# EAGLE design GPRS+GSM+GPS Shield v1.0 (EAGLE 6.3)
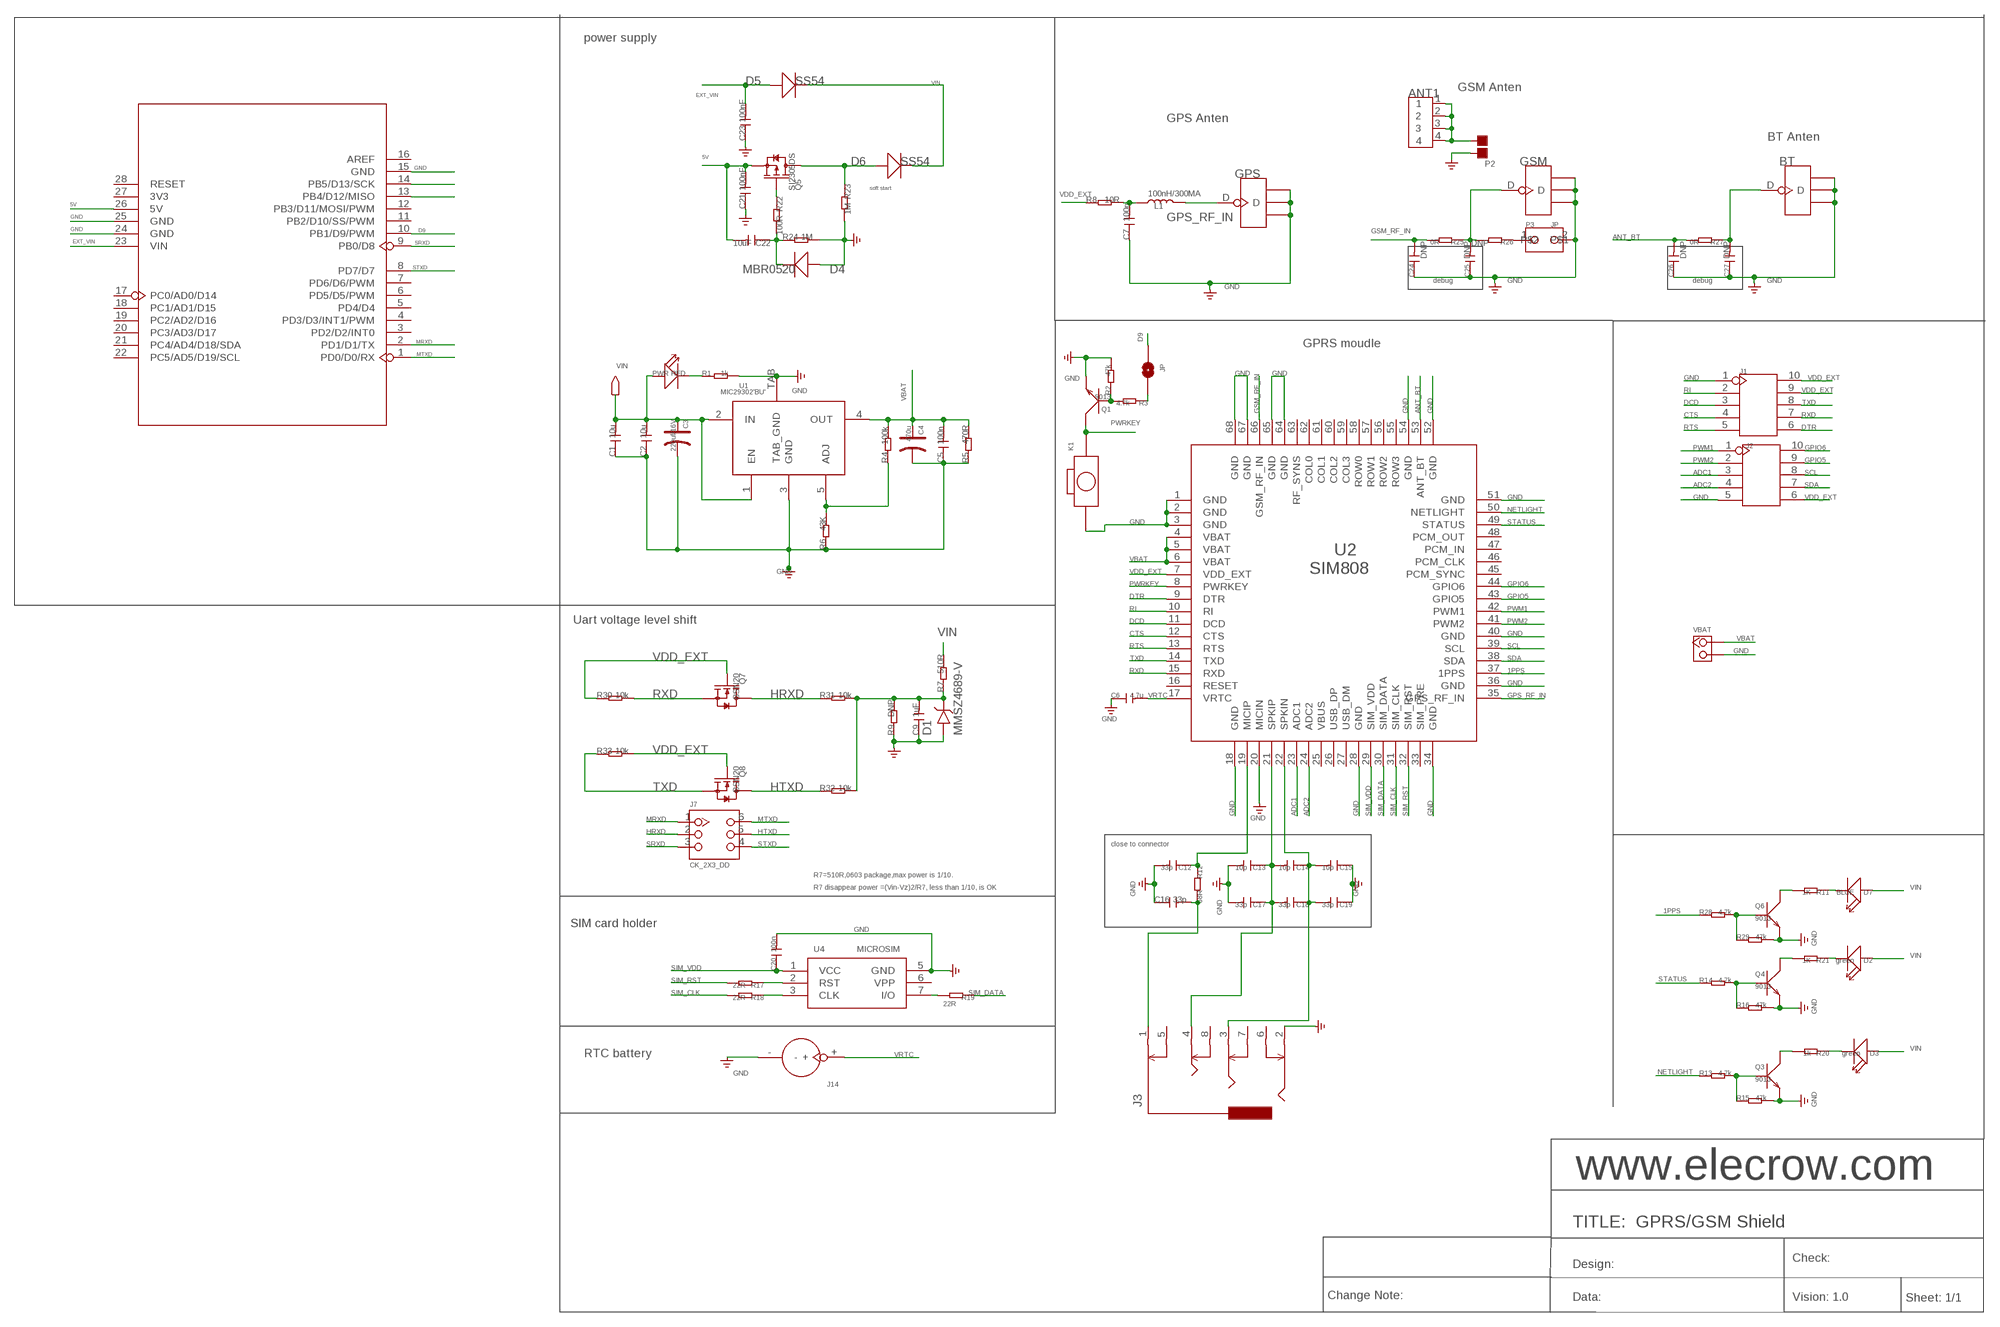
[diagram p0: schematic, sheet 1]

## Parts
ANT1  ANTENNA-SMA-IPX  [SMA-TO-IPX]
BT  ANTENNA-U-FL  [4P-U-FL]
C1  10u  C-0603  [C0603]
C2  10u  C-0603  [C0603]
C3  220uf/16V  006-CAP_AVX_D  [AVX_D]
C4  470u  006-CAP_AVX_D  [AVX_D]
C5  100n  C-0603  [C0603]
C6  4.7u  C-0805  [C0805]
C7  100n  C-0603  [C0603]
C9  1uF  C-0603  [C0603]
C12  33p  C-0603  [C0603]
C13  10p  C-0402  [C0402]
C14  10p  C-0402  [C0402]
C15  10p  C-0402  [C0402]
C16  33p  C-0603  [C0603]
C17  33p  C-0402  [C0402]
C18  33p  C-0402  [C0402]
C19  33p  C-0402  [C0402]
C20  100n  C-0603  [C0603]
C21  100nF  C-0603  [C0603]
C22  10uF  C-0805  [C0805]
C23  100nF  C-0603  [C0603]
C24  DNP  C-0402  [C0402]
C25  DNP  C-0402  [C0402]
C26  DNP  C-0402  [C0402]
C27  DNP  C-0402  [C0402]
D1  MMSZ4689-V  D-VOL'MMSZ4681'  [SOD123-2.7X1.6]
D2  green  LED'0603'  [LED-0603]
D3  green  LED'0603'  [LED-0603]
D4  MBR0520  D'MBR0520LT1'  [SOD123-2.7X1.6]
D5  SS54  D'MBRS240LT3'  [SMB]
D6  SS54  D'MBRS240LT3'  [SMB]
D7  BLUE  LED'0603'  [LED-0603]
GPS  ANTENNA-U-FL  [4P-U-FL]
GSM  ANTENNA-U-FL  [4P-U-FL]
J1  HEADER-2X5P-2.54  [2X5P-2.54]
J2  HEADER-2X5P-2.54  [2X5P-2.54]
J3  AUDIO-8P'PJ-3536-L6S'  [8P-3.5-SMD]
J7  CK_2X3_DD  [CK_2X3]
J14  HOLDER-BATTERY-2P-CR1220  [CR1220]
JP  0R/0805  PAD-SOLDERJUMPERNC  [2P-SMD-3.3X2]
K1  BOTTON_1_DP  [BTN_5.0_RST]
L1  100nH/300MA  L'0603'  [L0603]
P2  PAD-JUMPER-2P  [2P-SMD-1.78X1.27]
P3  JP  [JP]
PWR  RED  007-LED0603  [D0603]
Q1  9013  TRANSISTOR-NPN-SOT23  [SOT23]
Q3  9013  TRANSISTOR-NPN-SOT23  [SOT23]
Q4  9013  TRANSISTOR-NPN-SOT23  [SOT23]
Q5  SI2305DS  MOSFET-P'SI2323CDS/SI2305DS<BR>'  [SOT23]
Q6  9013  TRANSISTOR-NPN-SOT23  [SOT23]
Q7  BSN20  MOSFET-N'SOT23'  [SOT23]
Q8  BSN20  MOSFET-N'SOT23'  [SOT23]
R1  1k  R-0603  [R0603]
R2  47k  R-0603  [R0603]
R3  4.7k  R-0603  [R0603]
R4  100k  R-0603  [R0603]
R5  470R  R-0603  [R0603]
R6  43K  R-0603  [R0603]
R7  510R  R-0603  [R0603]
R8  10R  R-0603  [R0603]
R9  DNP  R-0603  [R0603]
R11  1K  R-0603  [R0603]
R12  68R  R-0603  [R0603]
R13  4.7k  R-0603  [R0603]
R14  4.7k  R-0603  [R0603]
R15  47k  R-0603  [R0603]
R16  47k  R-0603  [R0603]
R17  22R  R-0603  [R0603]
R18  22R  R-0603  [R0603]
R19  22R  R-0603  [R0603]
R20  1k  R-0603  [R0603]
R21  1K  R-0603  [R0603]
R22  100R  R-0603  [R0603]
R23  1M  R-0603  [R0603]
R24  1M  R-0603  [R0603]
R25  0R  R-0402  [R0402]
R26  DNP  R-0402  [R0402]
R27  0R  R-0402  [R0402]
R28  4.7k  R-0603  [R0603]
R29  47k  R-0603  [R0603]
R30  10k  R-0603  [R0603]
R31  10k  R-0603  [R0603]
R32  10k  R-0603  [R0603]
R33  10k  R-0603  [R0603]
U1  MIC29302'BU'  [TO-263]
U2  SIM808  [SIM808]
U3  UNO-SHILED  [SHILED]
U4  MICROSIM  [MICROSIM]
VBAT  DNP  HEADER_1X2_2.54  [CK_1*2]

## Nets
1PPS: R28.1 U2.37(1PPS)
5V: C21.2 C22.2 Q5.2(S) U3.26(5V)
ADC1: J2.3 U2.23(ADC1)
ADC2: J2.4 U2.24(ADC2)
ANT_BT: C26.2 R27.2 U2.53(ANT_BT)
CTS: J1.4 U2.12(CTS)
D9: JP.1 U3.10(PB1/D9/PWM)
DCD: J1.3 U2.11(DCD)
DTR: J1.6 U2.9(DTR)
EXT_VIN: C23.2 D5.+ U3.23(VIN)
GND: BT.GND1 BT.GND2 BT.GND3 C1.1 C2.1 C3.- C4.- C5.1 C6.1 C7.1 C9.1 C12.2 C13.2 C15.1 C16.1 C17.2 C19.1 C20.2 C21.1 C23.1 C24.1 C25.1 C26.1 C27.1 D1.1 D4.1(+) GPS.GND1 GPS.GND2 GPS.GND3 GSM.GND1 GSM.GND2 GSM.GND3 J1.1 J2.5 J3.2 J14.- K1.P$1 P2.2 P3.2 Q1.2(E) Q3.2(E) Q4.2(E) Q6.2(E) R1.2 R2.2 R5.1 R6.1 R9.1 R15.2 R16.2 R23.2 R24.2 R29.2 U1.3(GND) U1.TAB(TAB_GND) U2.1(GND) U2.2(GND) U2.3(GND) U2.18(GND) U2.20(MICIN) U2.28(GND) U2.34(GND) U2.36(GND) U2.40(GND) U2.51(GND) U2.52(GND) U2.54(GND) U2.64(GND) U2.65(GND) U2.67(GND) U2.68(GND) U3.15(GND) U3.24(GND) U3.25(GND) U4.5(GND) VBAT.2
GPIO5: J2.9 U2.43(GPIO5)
GPIO6: J2.10 U2.44(GPIO6)
GPS_RF_IN: GPS.D L1.2 U2.35(GPS_RF_IN)
GSM_RF_IN: C24.2 R25.2 U2.66(GSM_RF_IN)
HRXD: J7.2 Q7.3(D) R31.1
HTXD: J7.5 Q8.3(D) R32.1
MRXD: J7.1 U3.2(PD1/D1/TX)
MTXD: J7.6 U3.1(PD0/D0/RX)
N$1: R19.2 U4.7(I/O)
N$2: R4.1 R6.2 U1.5(ADJ)
N$3: Q3.3(C) R20.2
N$4: Q6.3(C) R11.2
N$5: R18.1 U4.3(CLK)
N$6: R17.1 U4.2(RST)
N$7: D3.- R20.1
N$8: Q3.1(B) R13.2 R15.1
N$9: C9.2 D1.2 R7.1 R9.2 R31.2 R32.2
N$11: Q5.1(G) R22.1
N$12: ANT1.1 ANT1.2 ANT1.3 ANT1.4 P2.1
N$13: C12.1 R12.1 U2.19(MICIP)
N$14: JP.2 R3.1
N$15: C13.1 C14.2 C17.1 C18.2 J3.4 U2.21(SPKIP)
N$16: Q4.3(C) R21.2
N$17: D2.- R21.1
N$18: Q4.1(B) R14.2 R16.1
N$19: C14.1 C15.2 C18.1 C19.2 J3.3 U2.22(SPKIN)
N$20: D6.+ Q5.3(D) R23.1
N$21: C7.2 L1.1 R8.2
N$22: D7.- R11.1
N$23: U3.14(PB5/D13/SCK)
N$24: Q6.1(B) R28.2 R29.1
N$25: C25.2 GSM.D R25.1 R26.2
N$26: P3.1 R26.1
N$27: U3.13(PB4/D12/MISO)
N$28: BT.D C27.2 R27.1
N$30: C16.2 J3.1 R12.2
N$36: Q1.1(B) R2.1 R3.2
N$39: C22.1 D4.2(-) R22.2 R24.1
N$53: PWR.- R1.1
NETLIGHT: R13.1 U2.50(NETLIGHT)
PWM1: J2.1 U2.42(PWM1)
PWM2: J2.2 U2.41(PWM2)
PWRKEY: K1.P$2 Q1.3(C) U2.8(PWRKEY)
RI: J1.2 U2.10(RI)
RTS: J1.5 U2.13(RTS)
RXD: J1.7 Q7.2(S) R30.2 U2.15(RXD)
SCL: J2.8 U2.39(SCL)
SDA: J2.7 U2.38(SDA)
SIM_CLK: R18.2 U2.31(SIM_CLK)
SIM_DATA: R19.1 U2.30(SIM_DATA)
SIM_RST: R17.2 U2.32(SIM_RST)
SIM_VDD: C20.1 U2.29(SIM_VDD) U4.1(VCC)
SRXD: J7.3 U3.9(PB0/D8)
STATUS: R14.1 U2.49(STATUS)
STXD: J7.4 U3.8(PD7/D7)
TXD: J1.8 Q8.2(S) R33.1 U2.14(TXD)
VBAT: C4.+ C5.2 R4.2 R5.2 U1.4(OUT) U2.4(VBAT) U2.5(VBAT) U2.6(VBAT) VBAT.1
VDD_EXT: J1.9 J1.10 J2.6 Q7.1(G) Q8.1(G) R8.1 R30.1 R33.2 U2.7(VDD_EXT)
VIN: C1.2 C2.2 C3.+ D2.+ D3.+ D5.- D6.- D7.+ PWR.+ R7.2 U1.1(EN) U1.2(IN)
VRTC: C6.2 J14.+ U2.17(VRTC)
Unconnected: J3.5 J3.6 J3.7 J3.8 U2.16(RESET) U2.25(VBUS) U2.26(USB_DP) U2.27(USB_DM) U2.33(SIM_PRE) U2.45(PCM_SYNC) U2.46(PCM_CLK) U2.47(PCM_IN) U2.48(PCM_OUT) U3.3(PD2/D2/INT0) U3.4(PD3/D3/INT1/PWM) U3.5(PD4/D4) U3.6(PD5/D5/PWM) U3.7(PD6/D6/PWM) U3.11(PB2/D10/SS/PWM) U3.12(PB3/D11/MOSI/PWM) U3.16(AREF) U3.17(PC0/AD0/D14) U3.18(PC1/AD1/D15) U3.19(PC2/AD2/D16) U3.20(PC3/AD3/D17) U3.21(PC4/AD4/D18/SDA) U3.22(PC5/AD5/D19/SCL) U3.27(3V3) U3.28(RESET) U4.6(VPP)

## Notes on the sheet
- power supply
- GSM Anten
- GPS Anten
- BT Anten
- soft start
- debug | debug
- GPRS moudle
- Uart voltage level shift
- close to connector
- R7=510R,0603 package,max power is 1/10.
- R7 disappear power =(Vin-Vz)2/R7, less than 1/10, is OK
- SIM card holder
- RTC battery
- www.elecrow.com
- TITLE:  GPRS/GSM Shield
- Check:
- Design:
- Change Note: | Data: | Vision: 1.0 | Sheet: 1/1

## Power pins joined to a net without a drawn wire
COL0: U2.62(COL0)
COL1: U2.61(COL1)
COL2: U2.60(COL2)
COL3: U2.59(COL3)
RF_SYNS: U2.63(RF_SYNS)
ROW0: U2.58(ROW0)
ROW1: U2.57(ROW1)
ROW2: U2.56(ROW2)
ROW3: U2.55(ROW3)

## Library data of the parts
ANT1 = Connector:ANTENNA-SMA-IPX
BT GPS GSM = Connector:ANTENNA-U-FL
C1 C2 C5-C7 C9 C12-C27 = Discrete:C*: Ceramic Capacitors
C3 C4 = Discrete:006-CAP*: Electrolytic Capacitors,Tantalum Capacitors and Super Capacitors
D1 = template:D-VOL
D2 D3 D7 = Discrete:LED*
D4-D6 = Discrete:D*
J1 J2 = Connector:HEADER-2X5P
J3 = template:AUDIO-8P
J7 = CONNECTER:CK_2X3
J14 = Connector:HOLDER-BATTERY-2P
JP = Discrete:PAD-SOLDERJUMPER: Solder Jumper Standard SMD solder jumper. Used to automate production. Two varients : Normally Open and Normally Closed are the same, but have different paste layers. NC will have a large amount of paste and should jumper during reflow.
K1 = CPT_SMD:BOTTON_1
L1 = Discrete:L*
P2 = Discrete:PAD-JUMPER-2P; PARTNO: DNP
P3 = mySeeed:JP
PWR = Discrete:007-LED*
Q1 Q3 Q4 Q6 = Discrete:TRANSISTOR-NPN*: NPN audion
Q5 = Discrete:MOSFET-P
Q7 Q8 = Discrete:MOSFET-N: IRLL014: http://www.vishay.com/docs/91319/sihll014.pdf
R1-R9 R11-R33 = Discrete:R*
U1 = ICs_v54:MIC29302
U2 = moudle:SIM808
U3 = ljb:UNO-SHILED
U4 = Connector:MICROSIM
VBAT = CONNECTER:HEADER_1X2

## Net classes
0 default: width 0.152 mm, drill 0.152 mm, clearance 0.152 mm

## Board
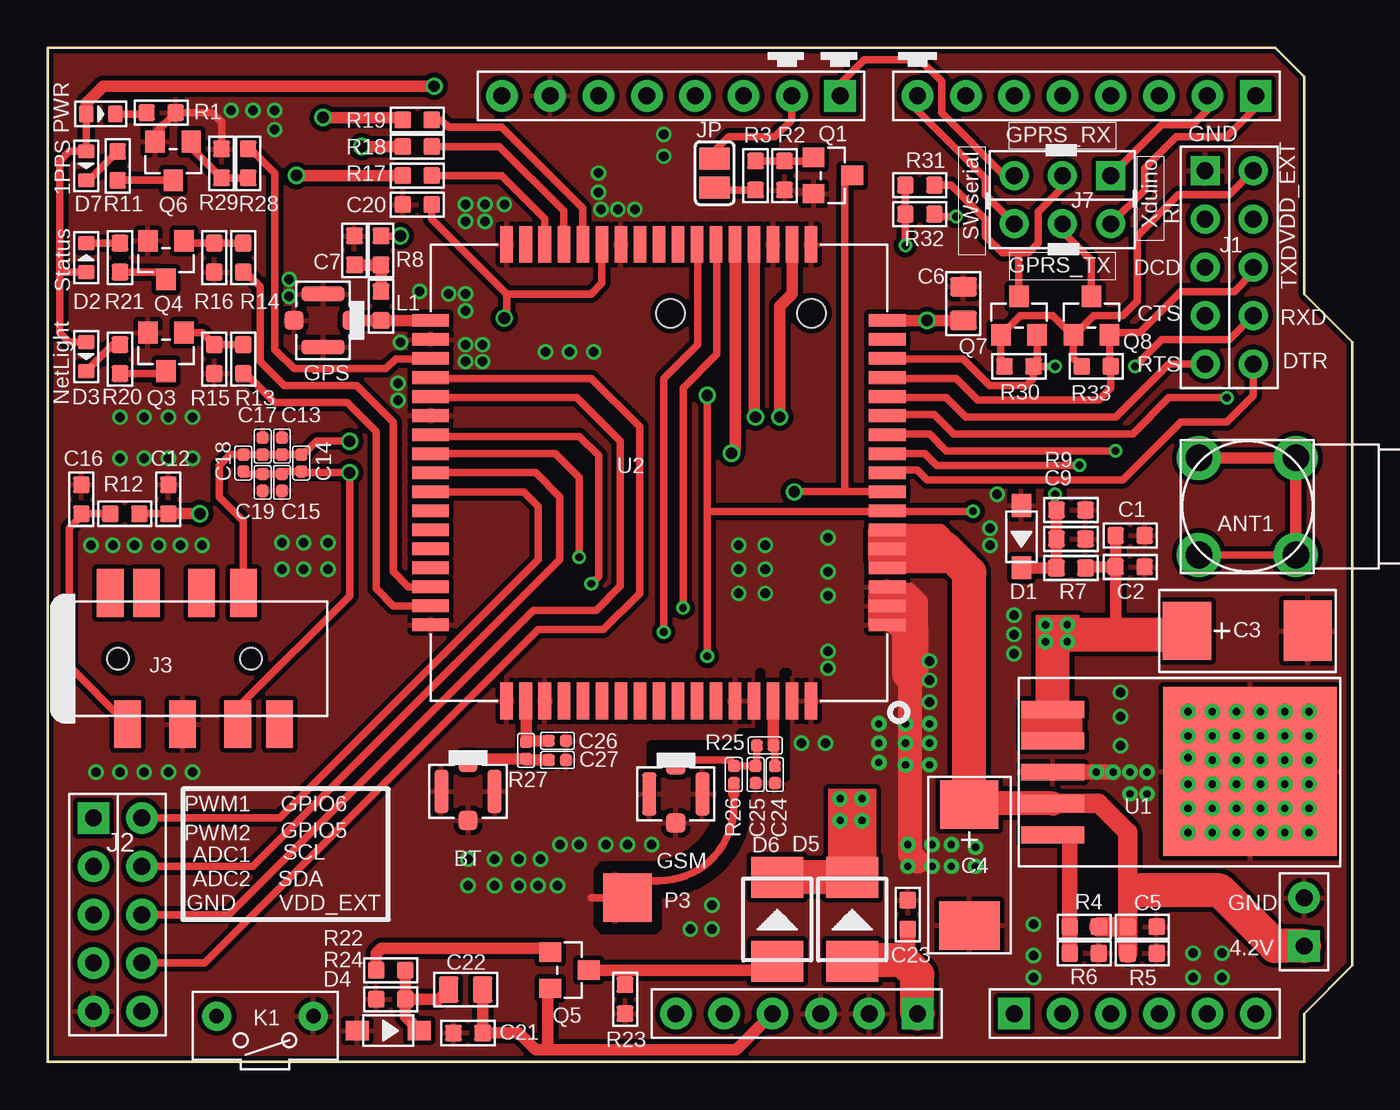
[diagram p1: board, top side]
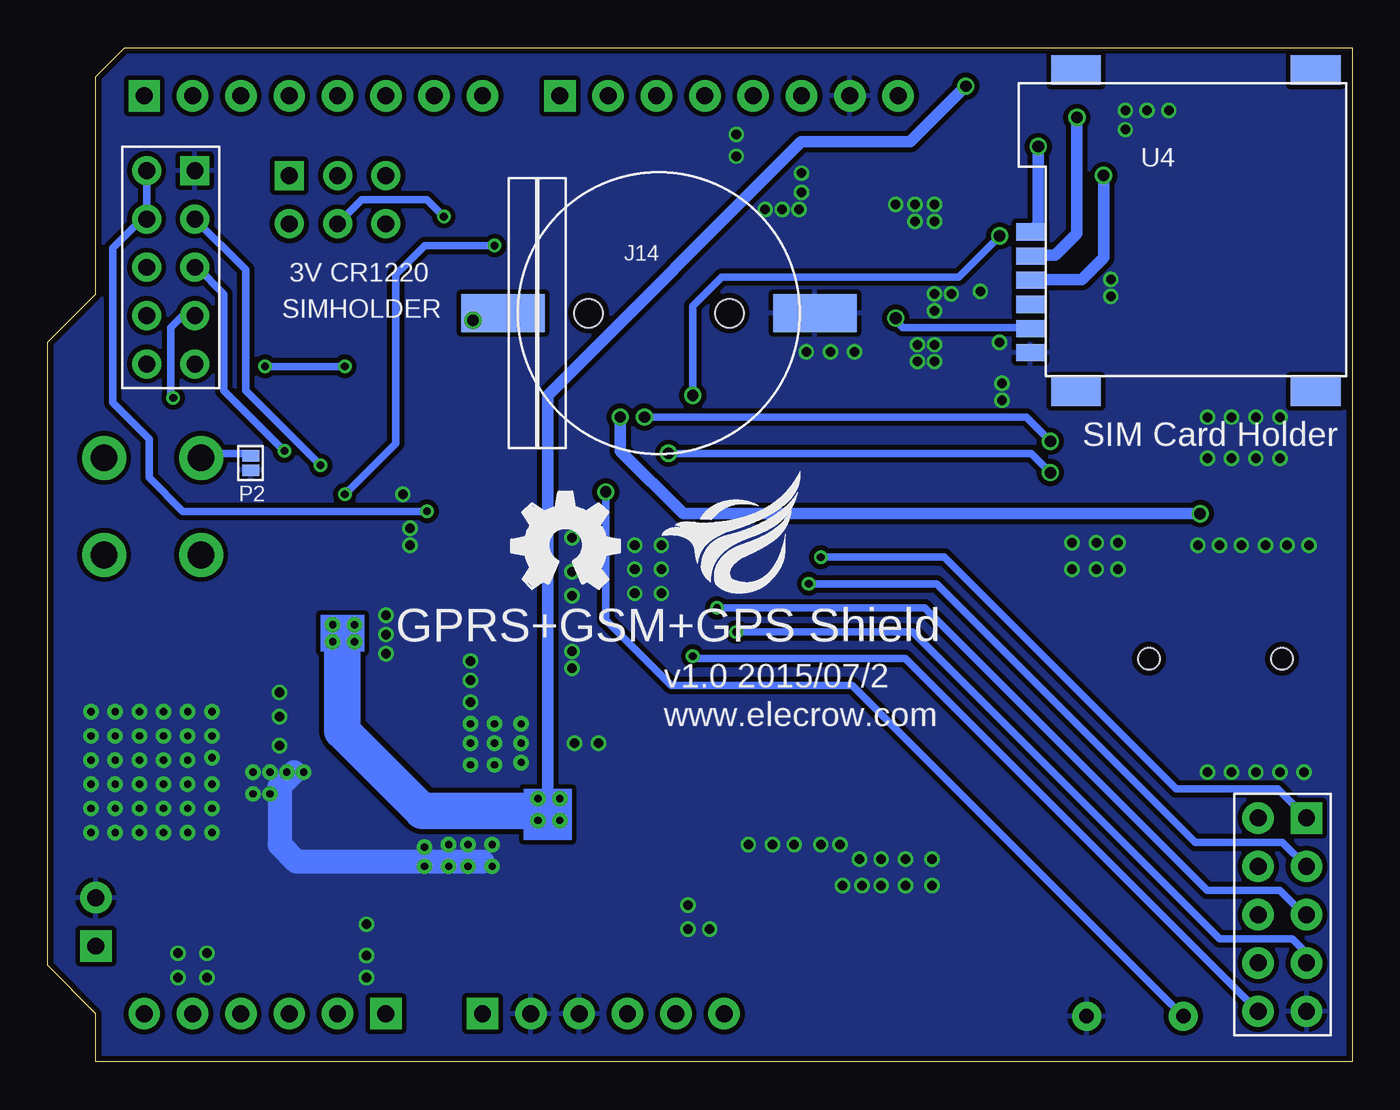
[diagram p2: board, bottom side, seen from below]

Size 68.58 x 53.34 mm. Coordinates in mm from the lower left corner, seen from the top.
Outline: 0,0 66.04,0 66.04,2.54 68.58,5.08 68.58,37.85 66.04,40.39 66.04,51.82 64.52,53.34 0,53.34 0,0
Copper layers (1*16): Top 0.035mm / dielectric 1.5mm / Bottom 0.035mm
Design rules "default *": minimum track width 6mil, minimum drill 12mil, track to track 10mil, track to pad 10mil, pad to pad 10mil, via to via 6mil, smd to smd 0mil, copper to edge 12mil, drill to drill 12mil, minimum pad ring 10mil, minimum via ring 6mil, stop-mask expansion 2mil, vias tented up to drill 100mil, thermal gap 10mil
tRestrict: area 35.6,41.9 to 35.7,43.3; 19 lines

### Footprints (pad centres in the part's own frame; a part is rotated, then mirrored left to right if it is on the bottom)
SMA-TO-IPX = drill 1.4 pad 2.3: 1 -2.55,2.55; 2 2.55,2.55; 3 2.55,-2.55; 4 -2.55,-2.55
4P-U-FL = smd 1.016 x 1.016: D -1.524,0; GND3 1.524,0 | smd 2.286 x 0.762: GND1 0,1.397; GND2 0,-1.397
C0603 = smd 0.889 x 0.889: 1 -0.762,0; 2 0.762,0
AVX_D = smd 2.54 x 3.048: + -3.175,0 | smd 2.54 x 3.175: - 3.175,0
C0805 = smd 1.016 x 1.397: 1 -0.889,0; 2 0.889,0
C0402 = smd 0.635 x 0.635: 1 -0.445,0; 2 0.445,0
SOD123-2.7X1.6 = smd 1.2 x 1.02: 1 -1.635,0; 2 1.635,0
D0603 = smd 0.762 x 0.889: + -0.762,0; - 0.762,0
SMB = smd 2.159 x 2.743: + -2.21,0; - 2.21,0
LED-0603 = smd 0.762 x 0.889: + -0.762,0; - 0.762,0
U-FL = smd 1.016 x 1.016: D -1.524,0; GND3 1.524,0 | smd 2.286 x 0.762: GND1 0,1.397; GND2 0,-1.397
2X5P-2.54-LEADED = drill 0.889 pad 1.524 square: 1 -1.27,5.08 | drill 0.889 pad 1.524: 2 -1.27,2.54; 3 -1.27,0; 4 -1.27,-2.54; 5 -1.27,-5.08; 6 1.27,-5.08; 7 1.27,-2.54; 8 1.27,0; 9 1.27,2.54; 10 1.27,5.08
2X5P-2.54 = drill 0.889 pad 1.651 square: 1 -1.27,5.08 | drill 0.889 pad 1.651: 2 -1.27,2.54; 3 -1.27,0; 4 -1.27,-2.54; 5 -1.27,-5.08; 6 1.27,-5.08; 7 1.27,-2.54; 8 1.27,0; 9 1.27,2.54; 10 1.27,5.08
8P-3.5-SMD = smd 1.4 x 2.5: 1 2.8,-3.45; 2 5.7,-3.45; 3 8.6,-3.45; 4 8.9,3.45; 5 1.9,3.45; 6 3.8,3.45; 7 6.7,3.45; 8 10.8,-3.45 | hole 1.149: 2.3,0; 9.3,0
CK_2X3 = drill 0.889 pad 1.524 square: 1 -1.27,2.54 | drill 0.889 pad 1.524: 2 -1.27,0; 3 -1.27,-2.54; 4 1.27,-2.54; 5 1.27,0; 6 1.27,2.54
CR1220 = smd 2 x 4.4: + 0,-8.2; - 0,8.2 | hole 1.5: 0,3.7; 0,-3.7
2P-SMD-3.3X2 = smd 1.168 x 1.6: 1 -0.762,0; 2 0.762,0
BTN_5.0_RST = drill 0.762 pad 1.524: P$1 0,2.54; P$2 0,-2.54
L0603 = smd 0.889 x 0.889: 1 -0.762,0; 2 0.762,0
2P-SMD-1.78X1.27 = smd 0.889 x 0.61: 1 0,0.381; 2 0,-0.381
JP = smd 1.27 x 2.54: 1 -0.635,0; 2 0.635,0
SOT23 = smd 1.016 x 1.143: 1 -0.95,-1.016; 2 0.95,-1.016; 3 0,1.016
R0603 = smd 0.889 x 0.889: 1 -0.762,0; 2 0.762,0
R0402 = smd 0.635 x 0.635: 1 -0.445,0; 2 0.445,0
TO-263 = smd 3.302 x 0.889: 1 3.302,-3.302; 2 3.302,-1.651; 3 3.302,0; 4 3.302,1.651; 5 3.302,3.302 | smd 9.12 x 8.89: TAB -7.071,-0.03
SIM808 = smd 1.93 x 0.66: 1 -10.349,7.238; 2 -10.349,6.238; 3 -10.349,5.238; 4 -10.349,4.238; 5 -10.349,3.238; 6 -10.349,2.238; 7 -10.349,1.238; 8 -10.349,0.238; 9 -10.349,-0.762; 10 -10.349,-1.762; 11 -10.349,-2.762; 12 -10.349,-3.762; 13 -10.349,-4.762; 14 -10.349,-5.762; 15 -10.349,-6.762; 16 -10.349,-7.762; 17 -10.349,-8.762; 35 13.651,-8.762; 36 13.651,-7.762; 37 13.651,-6.762; 38 13.651,-5.762; 39 13.651,-4.762; 40 13.651,-3.762; 41 13.651,-2.762; 42 13.651,-1.762; 43 13.651,-0.762; 44 13.651,0.238; 45 13.651,1.238; 46 13.651,2.238; 47 13.651,3.238; 48 13.651,4.238; 49 13.651,5.238; 50 13.651,6.238; 51 13.651,7.238 | smd 0.66 x 1.93: 18 -6.349,-12.762; 19 -5.349,-12.762; 20 -4.349,-12.762; 21 -3.349,-12.762; 22 -2.349,-12.762; 23 -1.349,-12.762; 24 -0.349,-12.762; 25 0.651,-12.762; 26 1.651,-12.762; 27 2.651,-12.762; 28 3.651,-12.762; 29 4.651,-12.762; 30 5.651,-12.762; 31 6.651,-12.762; 32 7.651,-12.762; 33 8.651,-12.762; 34 9.651,-12.762; 52 9.651,11.238; 53 8.651,11.238; 54 7.651,11.238; 55 6.651,11.238; 56 5.651,11.238; 57 4.651,11.238; 58 3.651,11.238; 59 2.651,11.238; 60 1.651,11.238; 61 0.651,11.238; 62 -0.349,11.238; 63 -1.349,11.238; 64 -2.349,11.238; 65 -3.349,11.238; 66 -4.349,11.238; 67 -5.349,11.238; 68 -6.349,11.238
SHILED = drill 0.889 pad 1.651 square: 1 63.5,50.8; 9 41.656,50.8; 17 50.8,2.54; 23 45.72,2.54 | drill 0.889 pad 1.651: 2 60.96,50.8; 3 58.42,50.8; 4 55.88,50.8; 5 53.34,50.8; 6 50.8,50.8; 7 48.26,50.8; 8 45.72,50.8; 10 39.116,50.8; 11 36.576,50.8; 12 34.036,50.8; 13 31.496,50.8; 14 28.956,50.8; 15 26.416,50.8; 16 23.876,50.8; 18 53.34,2.54; 19 55.88,2.54; 20 58.42,2.54; 21 60.96,2.54; 22 63.5,2.54; 24 43.18,2.54; 25 40.64,2.54; 26 38.1,2.54; 27 35.56,2.54; 28 33.02,2.54
MICROSIM = smd 1.5 x 0.9: 1 -0.8,2.5; 2 -0.8,5.04; 3 -0.8,7.58; 5 -0.8,1.23; 6 -0.8,3.77; 7 -0.8,6.31 | smd 2.61 x 1.56: P$1 1.6,-0.8; P$2 14.2,-0.8; P$3 14.2,16.1; P$4 1.6,16.1
CK_1*2 = drill 0.889 pad 1.651 square: 1 0,1.27 | drill 0.889 pad 1.651: 2 0,-1.27

### Placement (x,y rotation side)
ANT1  63.06,29.21 90 top
BT  22.1,14.22 270 top
C1  56.9,27.69 180 top
C2  56.9,26.04 180 top
C3  63.06,22.67 0 top
C4  48.45,10.35 270 top
C5  57.53,7.11 180 top
C6  48.13,39.88 270 top
C7  16.13,42.67 270 top
C9  53.78,27.5 180 top
C12  6.35,29.59 90 top
C13  12.32,32.38 90 top
C14  13.34,31.5 90 top
C15  12.32,30.48 90 top
C16  1.78,29.59 270 top
C17  11.3,32.38 90 top
C18  10.29,31.5 90 top
C19  11.3,30.48 90 top
C20  19.43,45.09 180 top
C21  22.1,1.52 0 top
C22  21.97,3.81 0 top
C23  45.21,7.75 270 top
C24  38.23,15.11 90 top
C25  37.21,15.11 90 top
C26  26.8,16.89 180 top
C27  26.8,15.88 180 top
D1  51.18,27.62 270 top
D2  green  [D0603]  2.03,42.29 90 top
D3  green  [D0603]  2.03,37.08 270 top
D4  17.91,1.65 0 top
D5  42.29,7.49 90 top
D6  38.35,7.49 90 top
D7  2.03,47.12 270 top
GPS  [U-FL]  14.48,38.99 180 top
GSM  33.02,14.1 270 top
J1  [2X5P-2.54-LEADED]  62.1,41.78 0 top
J2  3.68,7.75 0 top
J3  1.4,21.21 0 top
J7  53.34,45.34 270 top
J14  36.45,39.37 270 bottom
JP  35.05,46.74 270 top
K1  11.43,2.41 270 top
L1  17.53,39.75 270 top
LOGO2  LOGO-OSHW-FILLX0200-NT  [OSHW_FILLX200_NOTEXT]  44.2,24.89 0 bottom
P2  57.91,31.5 0 bottom
P3  30.48,8.64 180 top
PWR  2.79,49.85 0 top
Q1  41.27,46.61 270 top
Q3  6.22,37.34 180 top
Q4  6.22,42.16 180 top
Q5  27.43,4.83 270 top
Q6  6.6,47.37 180 top
Q7  51.05,39.24 0 top
Q8  54.86,39.24 0 top
R1  5.97,49.91 0 top
R2  38.73,46.61 270 top
R3  37.21,46.61 90 top
R4  54.48,7.11 0 top
R5  57.53,5.71 180 top
R6  54.48,5.71 180 top
R7  53.78,25.97 0 top
R8  17.53,42.67 270 top
R9  53.78,29.02 180 top
R11  3.68,47.12 270 top
R12  4.06,28.83 180 top
R13  10.29,36.96 90 top
R14  10.29,42.29 90 top
R15  8.76,36.96 270 top
R16  8.76,42.29 270 top
R17  19.43,46.61 0 top
R18  19.43,48.13 0 top
R19  19.43,49.53 180 top
R20  3.81,36.96 270 top
R21  3.81,42.29 270 top
R22  18.03,4.83 0 top
R23  30.35,3.3 270 top
R24  18.03,3.3 180 top
R25  37.72,16.64 0 top
R26  36.07,15.11 90 top
R27  25.15,16.38 90 top
R28  10.54,47.24 270 top
R29  9.14,47.24 90 top
R30  51.05,36.58 0 top
R31  45.85,46.1 180 top
R32  45.85,44.58 180 top
R33  55.12,36.58 180 top
U1  56.13,15.24 180 top
U2  33.78,30.23 180 top
U3  0,0 0 top
U4  16.13,36.07 0 bottom
U$4  [ELECROW_NRW_6]  36.32,24.64 0 bottom
VBAT  66.04,7.37 180 top

### Tracks (layer width: path | path; a pad name or v marks a point on that pad's centre or on a via)
1PPS
  Top 0.406: U2.37 20.1,36.96 18.29,36.96 17.78,36.45 12.95,36.45 11.94,37.47 11.94,46.74 10.67,48.01 R28.1
5V
  Top 0.61: C22.2 C21.2 24.77,1.52 25.65,0.64 26.29,0.64 | U3.26 36.2,0.64 26.29,0.64 | Q5.2 26.29,3.75 26.29,0.64
ADC1  (via drill 0.41)
  Top 0.406: U2.23 35.18,42.94 35.18,37.21 33.4,35.43 v33.4,23.88
  Bottom 0.406: J2.3 2.54,7.75 3.81,9.02 7.62,9.02 22.48,23.88 v33.4,23.88
ADC2  (via drill 0.41)
  Top 0.406: U2.24 34.16,42.96 34.16,37.72 32.38,35.94 v32.38,22.61
  Bottom 0.406: 32.26,22.73 v32.38,22.61 23.11,22.61 6.99,6.48 3.17,6.48 2.41,5.71 J2.4
ANT_BT
  Top 0.61: U2.53 25.15,18.99 R27.2 25.15,16.89 C26.2
CTS  (via drill 0.41)
  Top 0.406: U2.12 44.18,34.04 46.61,34.04 47.62,33.02 57.02,33.02 58.93,34.92 v61.98,34.92
  Bottom 0.406: v61.98,34.92 62.1,35.05 62.1,38.61 61.47,39.24 J1.4
D9
  Top 0.406: JP.1 35.05,47.88 35.81,48.64 38.23,48.64 39.12,49.53 U3.10
DCD  (via drill 0.41)
  Top 0.406: U2.11 44.16,33.02 46.35,33.02 47.24,32.13 v56.13,32.13
  Bottom 0.406: v56.13,32.13 59.31,35.31 59.31,40.39 60.71,41.78 J1.3
DTR
  Top 0.406: U2.9 44.26,31.11 45.72,31.11 46.23,30.61 56.52,30.61 59.56,33.66 61.98,33.66 63.37,35.05 J1.6
EXT_VIN
  Top 0.813: C23.2 45.21,5.59 44.96,5.33
  Top 1.778: U3.23 45.72,4.57 44.96,5.33 42.34,5.33 D5.+
GND  (via drill 0.38 pad 0.81, 0.5)
  Top 0.406: Q6.2 5.65,48.83 R1.2 8.64,49.91 9.14,49.4 R29.2 | P3.2 28.57,8.64
  Top 0.61: U2.1 U2.2 U2.3 44.23,24.89 45.34,24.89 45.97,24.26 45.97,20.45 45.59,20.83 45.59,24.26 45.21,24.64 44.83,24.64 44.7,24.51 43.43,24.51 43.43,22.99 44.45,22.99 45.47,21.97 45.47,20.32 45.34,20.45
  Top 0.813: U1.3 55.63,15.24 | 45.47,20.32 45.47,20.19
  Top 1.27: 45.72,10.54 45.34,10.92 45.34,20.45
  Top 1.93: U2.2 45.34,22.78 45.34,20.45
  Bottom 1.27: 55.63,15.24 56.39,14.48 56.39,11.43 55.5,10.54 45.72,10.54
  other vias: 59.94,18.41 59.94,17.14 59.94,13.34 59.94,12.06 61.21,12.06 62.48,12.06 63.75,12.06 65.02,12.06 66.29,12.06 66.29,13.34 66.29,14.61 66.29,15.88 66.29,17.14 66.29,18.41 63.75,13.34 63.75,14.61 63.75,15.88 63.75,17.14 63.75,18.41 65.02,13.34 65.02,14.61 65.02,15.88 65.02,17.14 65.02,18.41 62.48,13.34 62.48,14.61 62.48,15.88 62.48,17.14 62.48,18.41 61.21,13.34 61.21,14.61 61.21,15.88 61.21,17.14 61.21,18.41 59.94,16 59.94,14.61 22.86,37.72 18.41,35.69 56.39,16.64 56.39,18.16 56.39,19.43 39.62,16.76 40.89,16.76 22.1,10.67 23.5,10.67 24.77,10.67 22.1,9.27 23.5,9.27 24.77,9.27 60.2,5.71 61.72,5.71 60.2,4.45 61.72,4.45 51.82,7.24 51.82,5.59 51.82,4.45 3.81,31.75 22.99,45.09 22.99,44.2 21.97,44.2 21.97,45.09 24,45.09 41.02,27.56 41.02,25.78 41.02,24.51 41.02,20.7 41.02,21.59 37.72,27.18 37.72,25.91 37.72,24.64 36.32,24.64 36.32,25.91 36.32,27.18 14.73,25.91 13.46,25.91 2.54,15.24 34.92,8.26 34.92,6.99 33.78,6.99 32.38,48.77 32.38,47.62 29.97,44.83 29.08,44.83 45.09,16.76 45.09,15.62 45.09,17.78 46.35,17.78 46.35,16.76 46.35,15.62 43.69,17.78 43.69,16.76 43.69,15.75 46.48,11.43 45.21,11.43 45.21,10.29 46.48,10.29 47.5,10.29 47.5,11.43 48.77,10.29 48.77,11.3 56.9,15.24 56.9,14.1 55.12,15.24 56.01,15.24 57.78,15.24 57.78,14.1 46.35,18.92 46.35,20.07 46.35,21.08 3.81,15.24 5.08,15.24 6.35,15.24 7.62,15.24 12.32,25.91 12.32,27.3 13.46,27.3 14.73,27.3 5.08,31.75 6.35,31.75 7.62,31.75 5.08,33.91 6.35,33.91 7.62,33.91 3.81,33.91 18.41,34.8 21.97,37.72 21.97,36.83 18.54,37.85 12.7,41.15 12.7,40.26 21.97,39.5 21.97,40.39 21.08,40.39 19.56,40.51 22.86,36.83 30.86,44.83 28.96,45.72 28.96,46.74 31.75,11.43 30.48,11.43 29.34,11.43 27.94,11.43 26.92,11.43 25.91,10.67 25.78,9.27 26.8,9.27 8.13,27.18 6.99,27.18 5.84,27.18 4.57,27.18 3.43,27.18 2.29,27.18 28.7,37.34 27.43,37.34 26.16,37.34 9.65,50.04 10.79,50.04 11.94,50.04 11.94,49.02 49.91,29.84 49.53,28.07 49.53,27.18 50.8,23.5 50.8,22.48 50.8,21.46
  pour Bottom (isolate 0.254): -1.27,-1.27 71.12,-1.27 71.12,54.61 -1.27,54.61
  pour Top (isolate 0.254): -1.27,-1.27 71.12,-1.27 71.12,54.61 -1.27,54.61
GPIO5
  Top 0.406: U2.43 25.65,30.99 26.92,29.72 26.92,26.42 10.79,10.29 J2.9
GPIO6
  Top 0.406: U2.44 20.15,29.97 25.02,29.97 25.78,29.21 25.78,26.42 12.19,12.83 J2.10
GPS_RF_IN
  Top 0.61: U2.35 L1.2 GPS.D
GSM_RF_IN
  Top 0.406: C24.2 38.23,16.57 R25.2 38.13,16.67
  Top 0.61: 38.13,16.67 U2.66
HRXD
  Top 0.406: J7.2 53.34,45.97 52.07,44.7 52.07,43.05 51.56,42.55 51.05,42.55 | R31.1 46.74,45.97 46.86,46.1 47.5,46.1 49.28,44.32 49.28,43.43 50.16,42.55 51.05,42.55 | Q7.3 51.05,42.55
HTXD  (via drill 0.41)
  Top 0.406: J7.5 53.34,43.69 54.86,42.16 Q8.3 | R32.1 46.74,44.45 v47.75,44.45
  Bottom 0.406: v47.75,44.45 48.64,45.34 52.07,45.34 J7.5
MRXD
  Top 0.406: J7.1 58.55,49.28 60.2,49.28 60.96,50.04 U3.2
MTXD
  Top 0.406: J7.6 57.66,45.85 57.66,46.99 59.31,48.64 61.98,48.64 63.5,50.16 U3.1
N$1  (via drill 0.61)
  Top 0.61: R19.2 18.54,49.66 v14.48,49.66
  Bottom 0.61: v14.48,49.66 14.48,43.56 15.62,42.42 16.89,42.42 U4.7
N$2
  Top 0.813: R6.2 R4.1 53.72,11.94 U1.5
N$3
  Top 0.406: Q3.3 6.1,36.2 R20.2
N$4
  Top 0.406: R11.2 Q6.3
N$5  (via drill 0.61)
  Top 0.61: R18.1 v16.51,48.13
  Bottom 0.61: U4.3 16.51,44.07 v16.51,48.13
N$6  (via drill 0.61)
  Top 0.61: R17.1 v13.08,46.61
  Bottom 0.61: v13.08,46.61 13.08,42.29 14.22,41.15 16.89,41.15 U4.2
N$7
  Top 0.406: D3.- 3.43,37.72 R20.1
N$8
  Top 0.406: R13.2 R15.1 8.13,38.35 Q3.1
N$9  (via drill 0.41)
  Top 0.254: 53.01,25.99 R7.1
  Top 0.406: R31.2 R32.2 v45.09,42.93 | R9.2 52.96,29.08 v52.96,29.84
  Top 0.61: D1.2 53.01,25.99 | R7.1 C9.2 R9.2
  Bottom 0.406: v52.96,29.84 50.29,32.51 50.29,41.4 48.77,42.93 v45.09,42.93
N$11
  Top 0.406: 26.22,5.97 Q5.1
  Top 0.61: R22.1 17.27,5.71 17.53,5.97 26.22,5.97
N$12
  Top 0.406: ANT1.1 ANT1.4
  Top 0.61: ANT1.4 ANT1.3 ANT1.2
  Bottom 0.406: P2.1 58.04,32 59.94,32 60.19,31.76 ANT1.2
N$13  (via drill 0.6)
  Top 0.406: C12.1 R12.1
  Top 0.61: v38.48,33.91 38.48,39.75 39.13,40.4 U2.19 | C12.1 v8,28.83
  Bottom 0.61: v8,28.83 35.18,28.83 38.48,32.13 v38.48,33.91
N$14
  Top 0.406: R3.1 35.18,45.85 JP.2
N$15  (via drill 0.6)
  Top 0.406: v15.88,32.64 14.16,32.64 13.4,31.88 C14.2 C13.1 C17.1 C18.2 9.59,31.94 9.02,31.37 9.02,29.72 10.29,28.45 10.29,24.67 J3.4
  Top 0.61: v37.21,33.91 37.13,33.99 U2.21
  Bottom 0.406: v37.21,33.91 17.14,33.91 v15.88,32.64
N$16
  Top 0.406: Q4.3 5.84,41.53 R21.2
N$17
  Top 0.406: D2.- R21.1
N$18
  Top 0.406: Q4.1 7.3,43.05 R16.1 R14.2
N$19  (via drill 0.6)
  Top 0.305: C18.1 10.41,30.92 | C15.2 12.45,31.05
  Top 0.406: J3.3 10.16,17.92 10.16,18.8 15.88,24.51 v15.88,30.99 13.4,30.99 C14.1 12.45,31.05 | 10.41,30.92 C19.2 C15.2
  Top 0.61: v35.94,32 36.13,32.19 U2.22
  Bottom 0.406: v15.88,30.99 16.89,32 v35.94,32
N$20
  Top 0.406: 37.9,4.83 D6.+
  Top 0.61: Q5.3 30.35,4.83 | 30.35,4.83 37.9,4.83 | R23.1 30.35,4.83
N$21
  Top 0.61: L1.1 R8.2 C7.2
N$22
  Top 0.406: D7.- 2.16,46.35 R11.1
N$24
  Top 0.406: Q6.1 7.55,48.07 R29.1 R28.2
N$25
  Top 0.406: GSM.D 33.27,15.88 35.88,15.88 R26.2 C25.2 37.27,15.62 R25.1
N$26
  Top 0.406: 36.07,14.1 36.07,13.46 arc-90 32.13,9.53 31.5,9.53 arc90 31.37,9.4 31.37,8.89 arc-90 P3.1
  Top 0.61: R26.1 36.07,14.1
N$28
  Top 0.61: C27.2 25.15,15.88 R27.1 22.1,15.94 BT.D
N$30
  Top 0.406: C16.2 R12.2 3.04,28.57 | J3.1 1.14,20.81 1.14,28.07 1.78,28.7 C16.2 | 1.78,28.57 C16.2
N$36
  Top 0.406: R3.2 R2.1 40.07,47.37 Q1.1
N$39
  Top 0.61: R24.1 R22.2 | R24.1 20.57,3.3 C22.1 | D4.2 18.8,2.4 R24.1
N$53
  Top 0.406: PWR.- 5.21,49.85 R1.1
NETLIGHT
  Top 0.406: U2.50 18.18,23.99 17.27,24.89 17.27,33.15 15.75,34.67 11.94,34.67 10.41,36.2 R13.1
PWM1  (via drill 0.41)
  Top 0.406: U2.42 20.15,32 26.67,32 27.94,30.73 v27.94,26.54
  Bottom 0.406: J2.1 3.94,14.35 9.27,14.35 21.46,26.54 v27.94,26.54
PWM2  (via drill 0.41)
  Top 0.406: U2.41 20.23,32.89 27.94,32.89 28.96,31.88 28.96,25.53 v28.57,25.15
  Bottom 0.406: J2.2 3.68,11.56 8.26,11.56 21.84,25.15 v28.57,25.15
PWRKEY  (via drill 0.6)
  Top 0.406: Q1.3 41.91,46.23 41.91,29.99 | 43.04,29.99 U2.8 | U2.8 44.12,29.97 | v39.24,29.97 39.26,29.99 41.91,29.99 | 41.91,29.99 U2.8
  Bottom 0.406: K1.P$2 26.29,19.81 35.81,19.81 39.24,23.24 v39.24,29.97
RI  (via drill 0.41)
  Top 0.406: U2.10 44.15,32 46.1,32 46.74,31.37 v54.23,31.37
  Bottom 0.406: v54.23,31.37 58.17,35.31 58.17,41.66 J1.2
RTS
  Top 0.406: U2.13 44.19,34.92 47.24,34.92 48.26,33.91 56.13,33.91 58.93,36.7 J1.5
RXD  (via drill 0.41)
  Top 0.406: R30.2 52,36.76 Q7.2 | U2.15 44.16,36.96 48.13,36.96 49.53,35.56 51.44,35.56 51.82,35.94 R30.2 | J1.7 62.1,37.97 58.55,37.97 v57.15,36.58 | v52.96,36.58 R30.2
  Bottom 0.406: v52.96,36.58 v57.15,36.58
SCL
  Top 0.406: U2.39 20.19,34.92 27.81,34.92 30.1,32.64 30.1,25.02 28.83,23.75 25.53,23.75 9.53,7.75 J2.8
SDA
  Top 0.406: U2.38 20.18,35.94 28.57,35.94 31.11,33.4 31.11,24.64 29.21,22.73 25.78,22.73 8.26,5.21 J2.7
SIM_CLK
  Top 0.406: U2.31 27.13,44.75 23.75,48.13 R18.2
SIM_DATA
  Top 0.406: U2.30 28.13,44.89 23.88,49.15 21.08,49.15 20.7,49.53 R19.1
SIM_RST
  Top 0.406: U2.32 26.13,44.35 23.88,46.61 R17.2
SIM_VDD  (via drill 0.61)
  Top 0.406: U2.29 29.13,40.94 28.57,40.39 24.13,40.39 | v24,39.12 24.13,39.24 24.13,40.39 | 24.13,40.39 20.19,44.32 C20.1
  Bottom 0.406: U4.1 16.97,38.61 23.62,38.61 24,38.99 v24,39.12
  Bottom 0.61: 23.96,39.08 v24,39.12
SRXD
  Top 0.406: J7.3 50.29,46.61 46.99,49.91 46.99,51.56 45.85,52.7 42.93,52.7 41.66,51.44 U3.9
STATUS
  Top 0.406: U2.49 18.95,24.99 18.16,25.78 18.16,33.66 16.26,35.56 12.45,35.56 11.18,36.83 11.18,40.77 10.41,41.53 R14.1
STXD
  Top 0.406: J7.4 49.28,45.59 49.28,46.48 45.72,50.04 U3.8
TXD
  Top 0.406: U2.14 44.18,35.94 47.75,35.94 48.9,34.8 55.24,34.8 55.88,35.43 R33.1 55.81,36.64 Q8.2 55.94,38.35 57.4,38.35 59.56,40.51 62.36,40.51 63.37,41.53 J1.8
VBAT
  Top 0.61: 47.37,27.56 46.94,27.99 U2.6 43.81,27.67 43.81,27.56 43.43,27.94 43.43,26.42 43.69,26.16 46.86,26.16 47.12,26.42 47.12,27.05 | U2.4 47.7,25.99 47.94,26.23
  Top 0.813: 56.77,9.14 56.77,9.02
  Top 1.016: R4.2 C5.2 | R5.2 C5.2 | U1.4 55.24,13.59 56.77,12.06 56.77,9.14 56.9,9.02 | C5.2 56.77,9.02 56.9,9.02 | 57.91,9.02 56.9,9.02
  Top 1.27: U1.4 48.51,13.59 C4.+ | 47.12,27.05 44.19,27.05 U2.5
  Top 1.778: VBAT.1 64.52,6.1 61.59,9.02 57.91,9.02 57.4,9.02 | C4.+ 48.45,25.72 47.94,26.23 47.12,27.05
VDD_EXT  (via drill 0.41, 0.6)
  Top 0.406: v48.64,28.96 44.16,28.96 U2.7 44.1,28.96 34.67,28.96 | R30.1 50.1,36.76 Q7.1 51.12,39.24 52.83,39.24 53.85,38.23 Q8.1 | R33.2 53.91,37.02 Q8.1 | J1.10 62.1,45.59 59.44,45.59 57.28,43.43 57.28,40.01 56.52,39.24 54.99,39.24 53.98,38.23 Q8.1 | v34.67,21.34 34.67,28.96 | 34.67,28.96 v34.67,35.05 | R8.1 v18.54,43.43
  Bottom 0.406: v48.64,28.96 61.47,28.96 63.25,30.73 63.25,32.77 65.15,34.67 65.15,42.8 63.63,44.32 J1.9 J1.10 | J2.6 23.5,21.21 34.54,21.21 v34.67,21.34 | v34.67,35.05 34.67,39.75 33.15,41.27 20.7,41.27 v18.54,43.43
VIN  (via drill 0.38 pad 0.81, 0.6)
  Top 0.406: PWR.+ D7.+ 1.14,47.88 0.64,47.37 0.64,41.66 | D2.+ 0.76,41.53 0.64,41.66 | 54.48,25.91 54.61,26.04 | 55.24,22.61 55.5,22.86 56.13,22.86 | 0.64,41.66 0.64,38.35 1.14,37.85 D3.+ | 52.58,22.99 53.09,22.99 53.09,22.48 | 53.59,22.48 v53.59,22.99 | 52.96,22.48 52.45,22.48 v52.45,22.1 | 52.96,22.23 52.96,22.35 52.96,22.48 | 52.96,22.23 52.45,22.23 v52.45,22.1 | 53.09,22.48 53.59,22.48 | 53.59,22.48 v53.59,22.1 | 53.09,22.48 52.96,22.48 | 52.96,22.23 52.96,21.84 | 52.32,22.1 v52.45,22.1 | 53.09,22.1 v52.45,22.1 | v52.45,22.1 v52.45,22.99 52.58,22.99 | 52.58,22.99 53.09,22.48 | 42.29,12.83 41.78,12.83 v41.66,12.7 | 42.67,13.72 42.67,13.84 v42.8,13.84 | v42.8,13.84 42.8,12.83 42.93,12.7 42.93,13.46 42.67,13.72 | 42.67,13.72 v42.8,13.84 | 42.04,13.46 42.67,13.72
  Top 0.61: 55.24,22.61 55.37,22.48 | C1.2 C2.2 | 54.48,25.91 R7.2 | 54.61,26.04 C2.2 | 56.13,22.86 C2.2 | D6.- 38.41,9.65 42.16,9.65 42.29,9.78 42.29,12.7 | 42.29,12.83 42.29,12.95 | v20.32,51.31 2.92,51.31 2.03,50.42 PWR.+
  Top 0.813: U1.2 51.56,16.89 51.56,18.54 U1.1 | U1.1 53.98,18.54 | 54.1,18.54 53.98,18.54 | 53.98,18.54 53.98,17.02 53.59,17.02 53.59,17.27 | 53.59,17.53 53.59,18.29 52.07,18.29 | 51.94,18.29 52.07,18.29 | 52.07,18.29 52.07,17.27 53.59,17.27 | 53.59,17.27 53.59,17.53 | 53.59,17.53 52.2,17.53 52.2,17.78 52.83,17.78 U1.1
  Top 1.778: D6.- D5.- 42.29,12.7 42.29,12.83 | U1.1 52.83,22.23 52.96,22.35 53.09,22.48 55.37,22.48 59.69,22.48 C3.+
  Bottom 0.406: v41.66,12.7 42.29,12.7 | 42.29,12.83 42.67,12.83 | 42.67,12.83 42.8,12.83 | 42.8,12.83 v42.8,12.7 | 42.29,12.83 42.29,13.21 | 42.29,12.83 41.78,12.83 v41.66,12.7 | v41.66,12.7 41.78,12.57 42.29,12.57 42.29,12.7 | 42.29,12.83 42.29,12.7 | 42.8,12.57 v42.8,12.7 | v42.8,12.7 42.67,12.83 | 42.67,12.83 42.04,13.08 | 53.09,22.48 v52.45,22.1 | 42.67,13.84 42.67,13.72 v42.8,13.84 42.67,13.84 | 42.67,13.84 v41.66,13.84 42.8,13.08 42.8,12.83 | 42.8,12.83 42.55,13.21
  Bottom 0.61: 42.29,12.95 42.29,13.21 42.29,35.05 28.96,48.39 23.24,48.39 v20.32,51.31
  Bottom 1.778: 42.29,12.83 42.29,12.95
  Bottom 1.93: 42.55,13.21 48.9,13.21 53.09,17.4 53.09,22.48
VRTC  (via drill 0.61)
  Top 0.61: U2.17 v46.23,38.99 C6.2
  Bottom 0.61: J14.+ 45.03,38.99 v46.23,38.99
(copper drawn outside any net)
  shapes: Bottom area x3, Top area x3

### Text on the board
tPlace: GPRS_RX | SWserial | GND | VDD_EXT | Xduino | 1PPS | RI | GPRS_TX | DCD | Status | TXD | CTS | RXD | RTS | DTR | NetLight | PWM1 | GPIO6 | GPIO5 | PWM2 | ADC1 | SCL | ADC2 | SDA | GND | VDD_EXT | GND | 4.2V
bPlace: 3V CR1220 | SIMHOLDER | SIM Card Holder | GPRS+GSM+GPS Shield | v1.0 2015/07/2 | www.elecrow.com